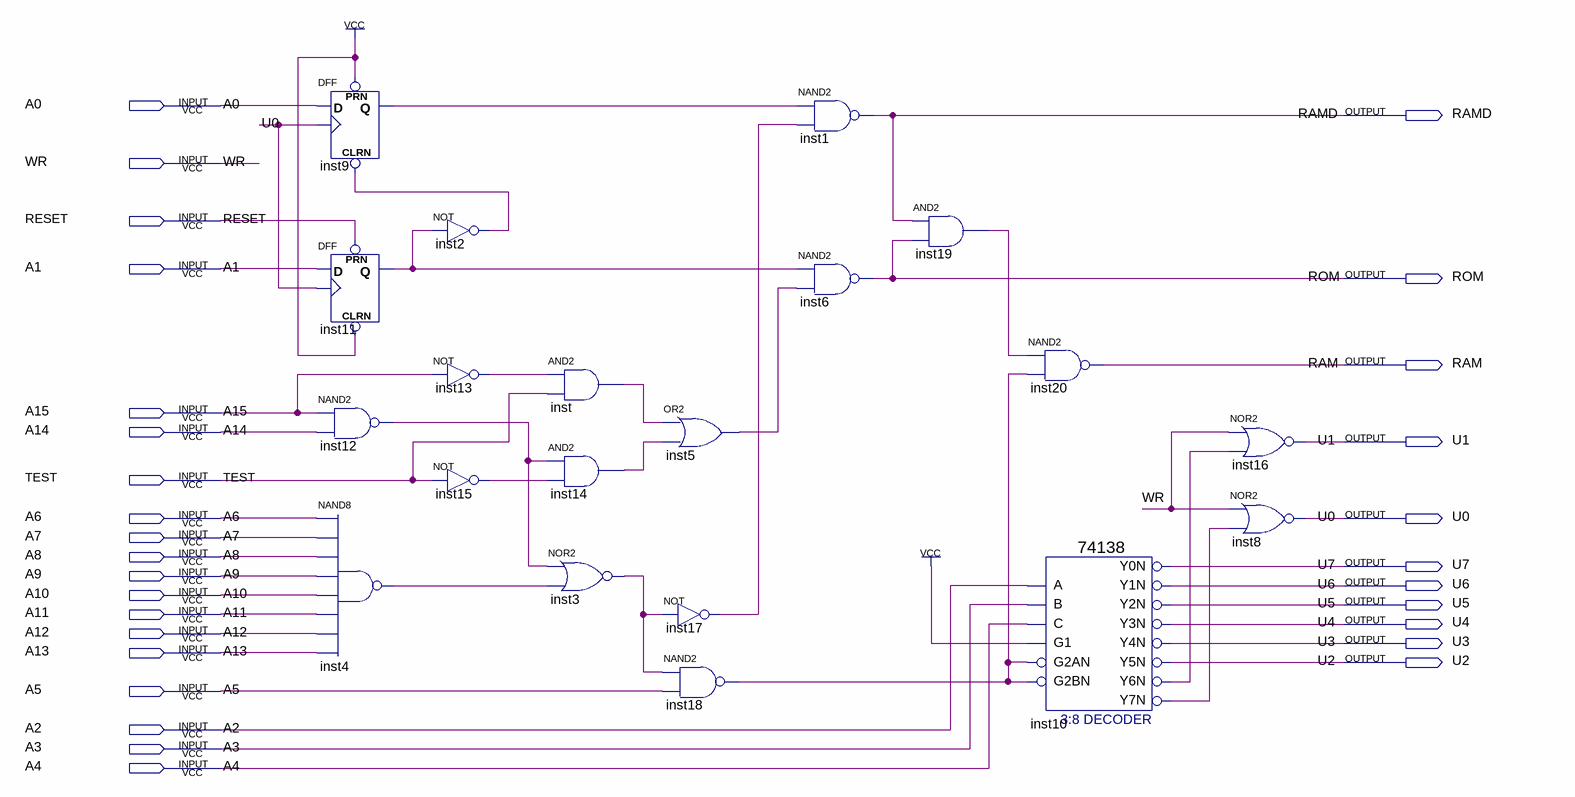
[diagram p0: schematic sheet]
// Quartus schematic AddrSelector.bdf as structural Verilog: 20 symbols, 30 pins
module AddrSelector (
  input  A0,
  input  WR,
  input  RESET,
  input  A1,
  input  A15,
  input  A14,
  input  TEST,
  input  A6,
  input  A7,
  input  A8,
  input  A9,
  input  A10,
  input  A11,
  input  A12,
  input  A13,
  input  A5,
  input  A2,
  input  A3,
  input  A4,
  output RAMD,
  output ROM,
  output RAM,
  output U1,
  output U0,
  output U7,
  output U6,
  output U5,
  output U4,
  output U3,
  output U2
);

  wire inst2_out, inst3_out, inst4_out, inst5_out, inst9_q, inst10_y6n, inst10_y7n, inst11_q, inst12_out,
       inst13_out, inst14_out, inst15_out, inst17_out, inst18_out, inst19_out, inst_out;

  DFF inst9 (.CLRN(inst2_out), .CLK(U0), .D(A0), .PRN(1'b1), .Q(inst9_q));
  DFF inst11 (.CLRN(1'b1), .CLK(U0), .D(A1), .PRN(RESET), .Q(inst11_q));
  nand inst12 (inst12_out, A15, A14);
  nand inst4 (inst4_out, A6, A7, A8, A9, A10, A11, A12, A13);
  not inst2 (inst2_out, inst11_q);
  not inst13 (inst13_out, A15);
  not inst15 (inst15_out, TEST);
  and inst (inst_out, inst13_out, TEST);
  and inst14 (inst14_out, inst12_out, inst15_out);
  nor inst3 (inst3_out, inst12_out, inst4_out);
  or inst5 (inst5_out, inst_out, inst14_out);
  not inst17 (inst17_out, inst3_out);
  nand inst18 (inst18_out, inst3_out, A5);
  nand inst1 (RAMD, inst9_q, inst17_out);
  nand inst6 (ROM, inst11_q, inst5_out);
  and inst19 (inst19_out, RAMD, ROM);
  nand inst20 (RAM, inst19_out, inst18_out);
  \74138  inst10 (
    .A(A2), .B(A3), .G1(1'b1), .C(A4), .G2AN(inst18_out), .G2BN(inst18_out), .Y0N(U7), .Y1N(U6), .Y2N(U5),
    .Y3N(U4), .Y4N(U3), .Y5N(U2), .Y6N(inst10_y6n), .Y7N(inst10_y7n));
  nor inst16 (U1, WR, inst10_y6n);
  nor inst8 (U0, WR, inst10_y7n);
endmodule
